# Altium schematic sheet Sheet1.SchDoc
size A4
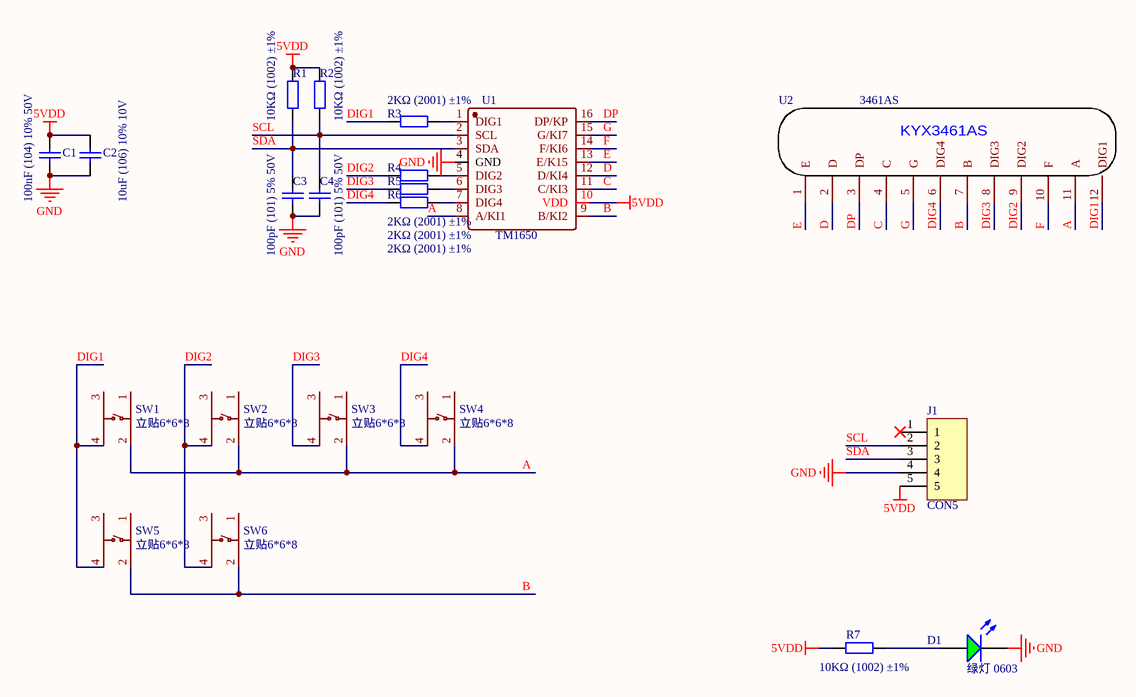
[diagram p0: Sheet1.SchDoc]

## Parts
C1  100nF (104) 10% 50V  [0603_C]
C2  10uF (106) 10% 10V  [0603_C]
C3  100pF (101) 5% 50V  [0603_C]
C4  100pF (101) 5% 50V  [0603_C]
D1  绿灯 0603  [0603_LED_S1]
J1  CON5  [XH2.54-5P]
R1  10KΩ (1002) ±1%  [0603_R]
R2  10KΩ (1002) ±1%  [0603_R]
R3  2KΩ (2001) ±1%  [0603_R]
R4  2KΩ (2001) ±1%  [0603_R]
R5  2KΩ (2001) ±1%  [0603_R]
R6  2KΩ (2001) ±1%  [0603_R]
R7  10KΩ (1002) ±1%  [0603_R]
SW1  立贴6*6*8  [SW]
SW2  立贴6*6*8  [SW]
SW3  立贴6*6*8  [SW]
SW4  立贴6*6*8  [SW]
SW5  立贴6*6*8  [SW]
SW6  立贴6*6*8  [SW]
U1  TM1650  [TM1650]
U2  3461AS  [3461AS]

## Nets
5VDD: C1.2 C2.2 J1.5 R1.2 R2.2 R7.1 U1.10(VDD)
GND: C1.1 C2.1 C3.1 C4.1 D1.K J1.4 U1.4(GND)
A: SW1.2 SW2.2 SW3.2 SW4.2 U1.8(A/KI1) U2.11(A)
B: SW5.2 SW6.2 U1.9(B/KI2) U2.7(B)
C: U1.11(C/KI3) U2.4(C)
D: U1.12(D/KI4) U2.2(D)
DIG1: R3.1 SW1.4 SW5.4 U2.12(DIG1)
DIG2: R4.1 SW2.4 SW6.4 U2.9(DIG2)
DIG3: R5.1 SW3.4 U2.8(DIG3)
DIG4: R6.1 SW4.4 U2.6(DIG4)
DP: U1.16(DP/KP) U2.3(DP)
E: U1.13(E/K15) U2.1(E)
F: U1.14(F/KI6) U2.10(F)
G: U1.15(G/KI7) U2.5(G)
SCL: C4.2 J1.2 R2.1 U1.2(SCL)
SDA: C3.2 J1.3 R1.1 U1.3(SDA)
NetD1_A: D1.A R7.2
NetR3_2: R3.2 U1.1(DIG1)
NetR4_2: R4.2 U1.5(DIG2)
NetR5_2: R5.2 U1.6(DIG3)
NetR6_2: R6.2 U1.7(DIG4)

Not connected (* = marked no-connect by the designer): J1 1*; SW1 1 3; SW2 1 3; SW3 1 3; SW4 1 3; SW5 1 3; SW6 1 3

## Notes on the sheet
- (in symbol 3461AS) KYX3461AS

## Library data of the parts
C1 = 0603 100nF (104) 10% 50V: 贴片电容; ComponentLink1Description: 供应商链接; ComponentLink1URL: http://www.szlcsc.com/product/details_15331.html; Package: 0603; Supplier: LC; SuppliersPartNumber: C14663
C2 = 0603 10uF (106) 10% 10V: 贴片电容; ComponentLink1Description: 供应商链接; ComponentLink1URL: http://www.szlcsc.com/product/details_20411.html; Package: 0603; Supplier: LC; SuppliersPartNumber: C19702
C3 C4 = 0603 100pF (101) 5% 50V: 贴片电容; ComponentLink1Description: 供应商链接; ComponentLink1URL: http://www.szlcsc.com/product/details_15530.html; Package: 0603; Supplier: LC; SuppliersPartNumber: C14858
D1 = 0603 绿灯: 发光二极管; ComponentLink1Description: 供应商链接; ComponentLink1URL: http://www.szlcsc.com/product/details_73152.html; Package: 0603; Supplier: LC; SuppliersPartNumber: C72043
R1 R2 R7 = 0603 10KΩ (1002) 1%: 贴片电阻; ComponentLink1Description: 供应商链接; ComponentLink1URL: http://www.szlcsc.com/product/details_26547.html; Package: 0603; Supplier: LC; SuppliersPartNumber: C25804
R3-R6 = 0603 2KΩ (2001) 1%: 贴片电阻; ComponentLink1Description: 供应商链接; ComponentLink1URL: http://www.szlcsc.com/product/details_23702.html; Package: 0603; Supplier: LC; SuppliersPartNumber: C22975
SW1-SW6 = SW